# EAGLE schematic QC_MOTOR_v0_1 (EAGLE 5.10)
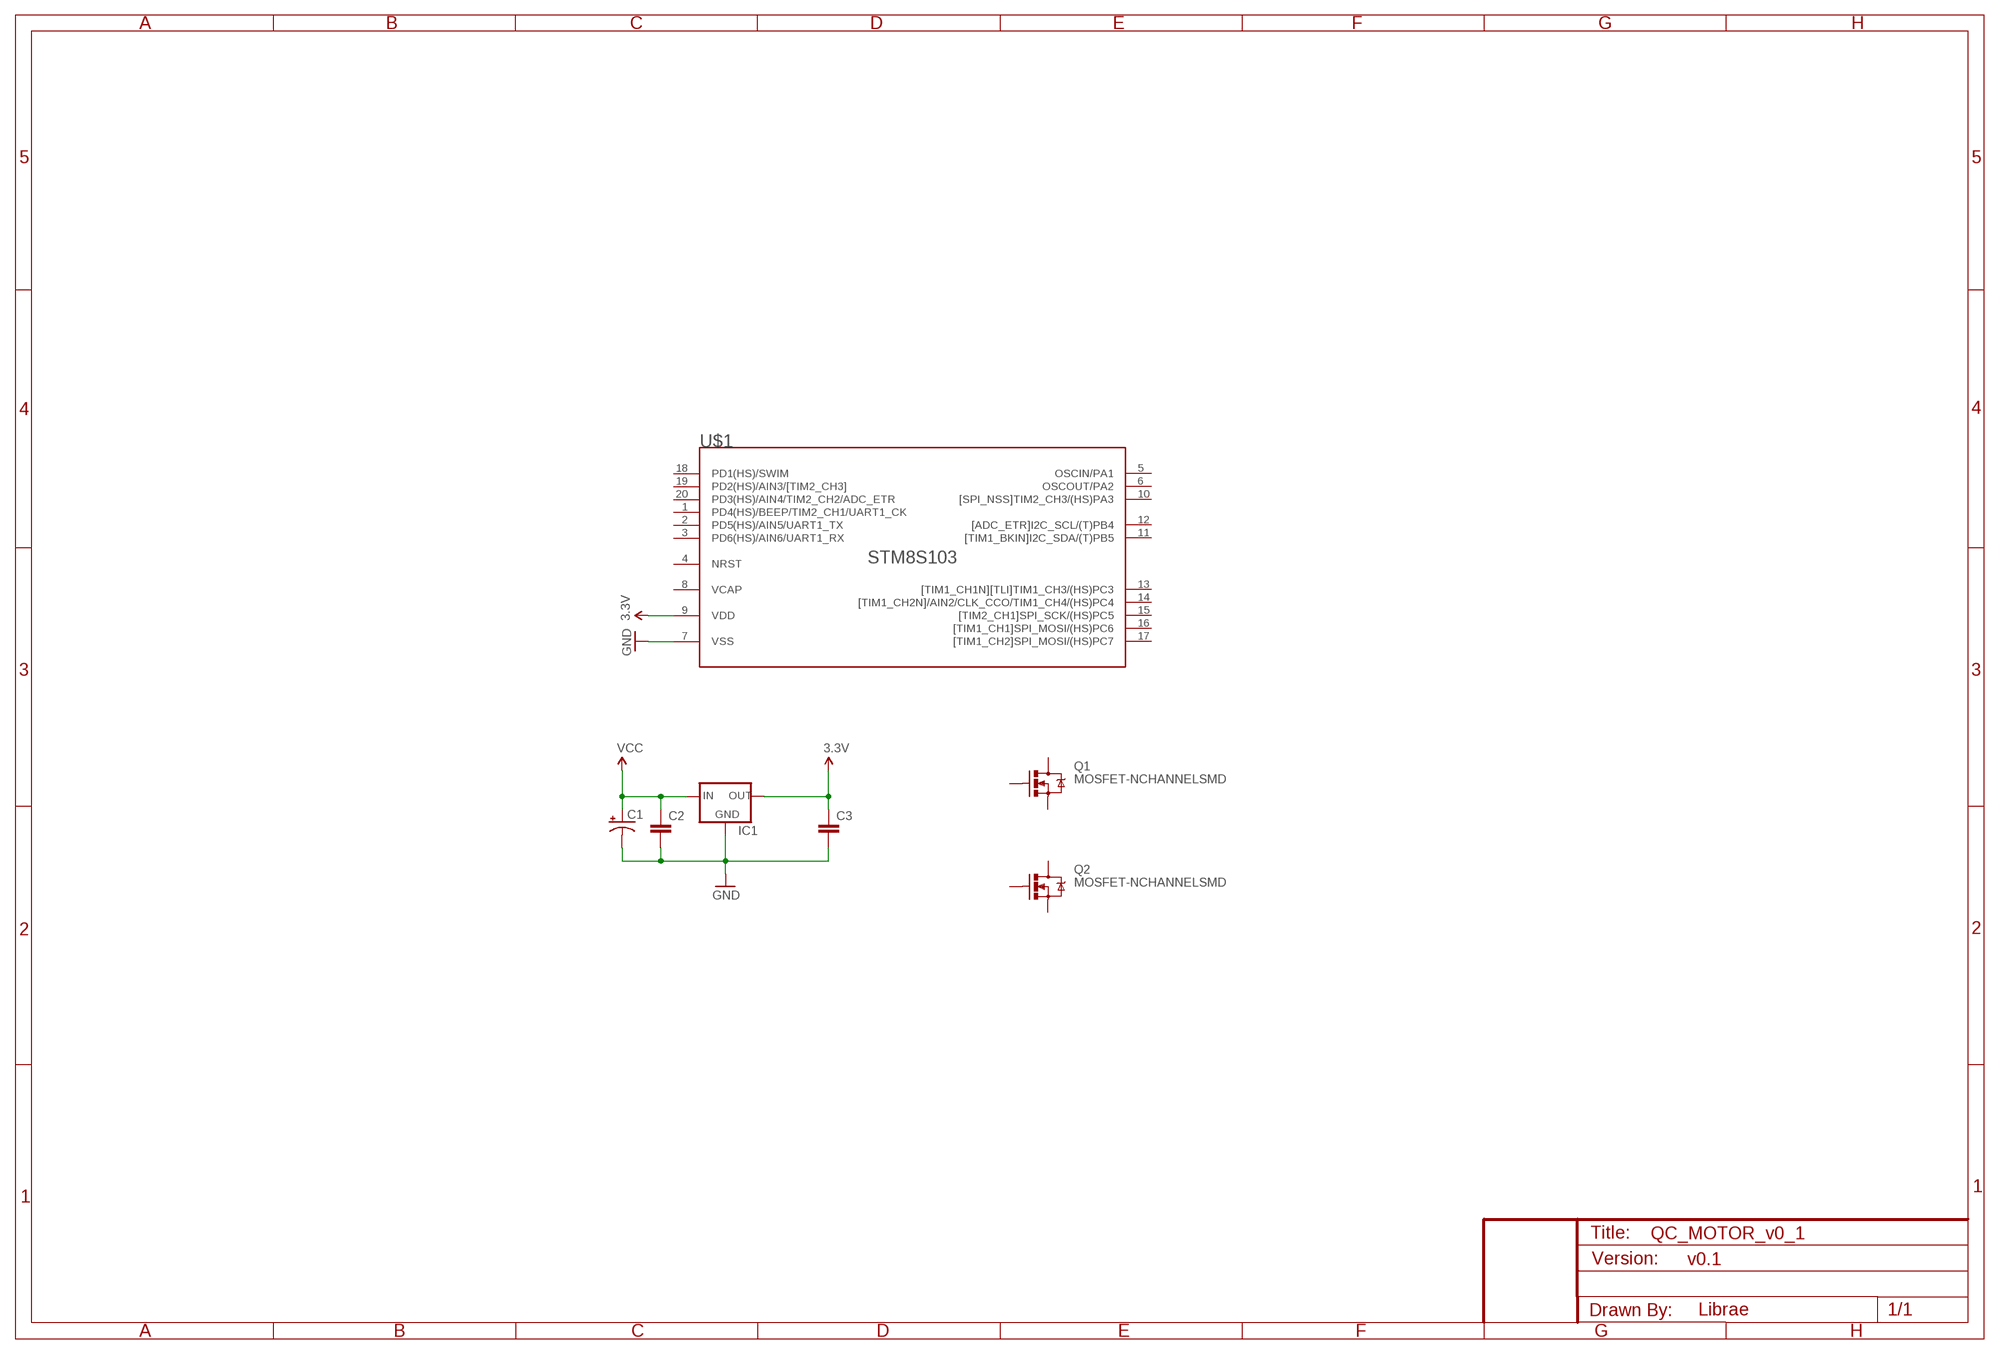
[diagram p0: schematic, sheet 1]

## Parts
C1  CAP_POL1206  [EIA3216]
C2  CAP0603-CAP  [0603-CAP]
C3  CAP0603-CAP  [0603-CAP]
IC1  78LXX-SOT89  [SOT89]
Q1  MOSFET-NCHANNELSMD  [SOT23-3]
Q2  MOSFET-NCHANNELSMD  [SOT23-3]
U$1  STM8SF103  [TSSOP20]

## Nets
3.3V: C3.1 IC1.1(OUT) U$1.9(VDD)
GND: C1.C(-) C2.2 C3.2 IC1.2(GND) U$1.7(VSS)
VCC: C1.A(+) C2.1 IC1.3(IN)
Unconnected: Q1.1(G) Q1.2(S) Q1.3(D) Q2.1(G) Q2.2(S) Q2.3(D) U$1.1(PD4(HS)/BEEP/TIM2_CH1/UART1_CK) U$1.2(PD5(HS)/AIN5/UART1_TX) U$1.3(PD6(HS)/AIN6/UART1_RX) U$1.4(NRST) U$1.5(OSCIN/PA1) U$1.6(OSCOUT/PA2) U$1.8(VCAP) U$1.10([SPI_NSS]TIM2_CH3/(HS)PA3) U$1.11([TIM1_BKIN]I2C_SDA/(T)PB5) U$1.12([ADC_ETR]I2C_SCL/(T)PB4) U$1.13([TIM1_CH1N][TLI]TIM1_CH3/(HS)PC3) U$1.14([TIM1_CH2N]/AIN2/CLK_CCO/TIM1_CH4/(HS)PC4) U$1.15([TIM2_CH1]SPI_SCK/(HS)PC5) U$1.16([TIM1_CH1]SPI_MOSI/(HS)PC6) U$1.17([TIM1_CH2]SPI_MOSI/(HS)PC7) U$1.18(PD1(HS)/SWIM) U$1.19(PD2(HS)/AIN3/[TIM2_CH3]) U$1.20(PD3(HS)/AIN4/TIM2_CH2/ADC_ETR)

## Notes on the sheet
- v0.1
- Librae

## Library data of the parts
C1 = SparkFun:CAP_POL: Capacitor Polarized These are standard SMD and PTH capacitors. Normally 10uF, 47uF, and 100uF in electrolytic and tantalum varieties. Always verify the external diameter of the through hole cap, it varies with capacity, voltage, and manufacturer. The EIA devices should be standard.
C2 C3 = SparkFun:CAP: Capacitor Standard 0603 ceramic capacitor, and 0.1" leaded capacitor.
IC1 = v-reg-3:78LXX: VOLTAGE REGULATOR
Q1 Q2 = SparkFun:MOSFET-NCHANNEL
U$1 = MyLib:STM8SF103: STM8S103xx TSSOP20